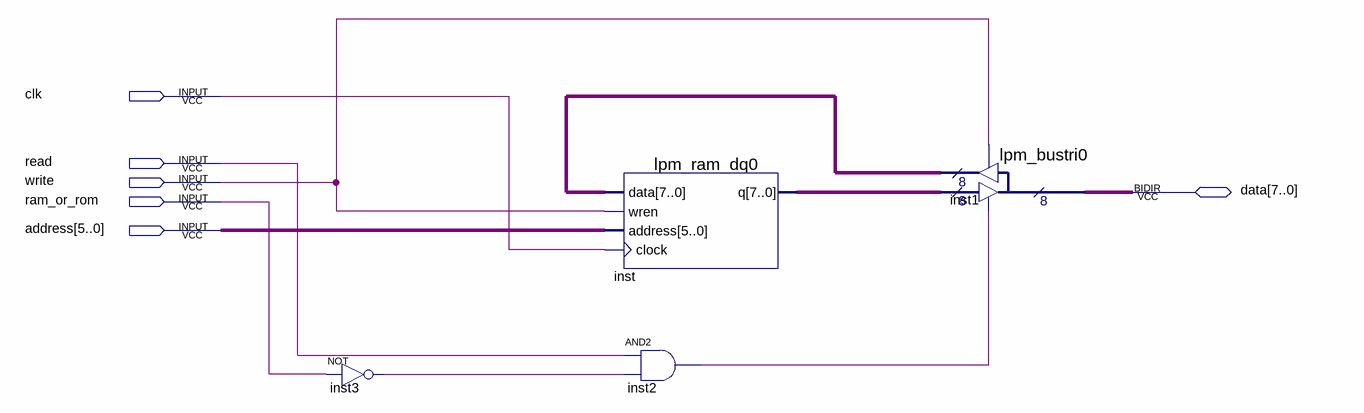
[diagram p0: schematic sheet]
// Quartus schematic RAM.bdf as structural Verilog: 4 symbols, 6 pins
module RAM (
  input  clk,
  input  read,
  input  write,
  input  ram_or_rom,
  input  [5:0] address,
  inout  [7:0] data
);

  wire inst2_out, inst3_out;
  wire [7:0] inst1_result, inst_q;

  not inst3 (inst3_out, ram_or_rom);
  lpm_ram_dq0 inst (.data(inst1_result), .wren(write), .address(address), .clock(clk), .q(inst_q));
  and inst2 (inst2_out, read, inst3_out);
  lpm_bustri0 inst1 (.enabledt(inst2_out), .data(inst_q), .enabletr(write), .result(inst1_result), .tridata(data));
endmodule
